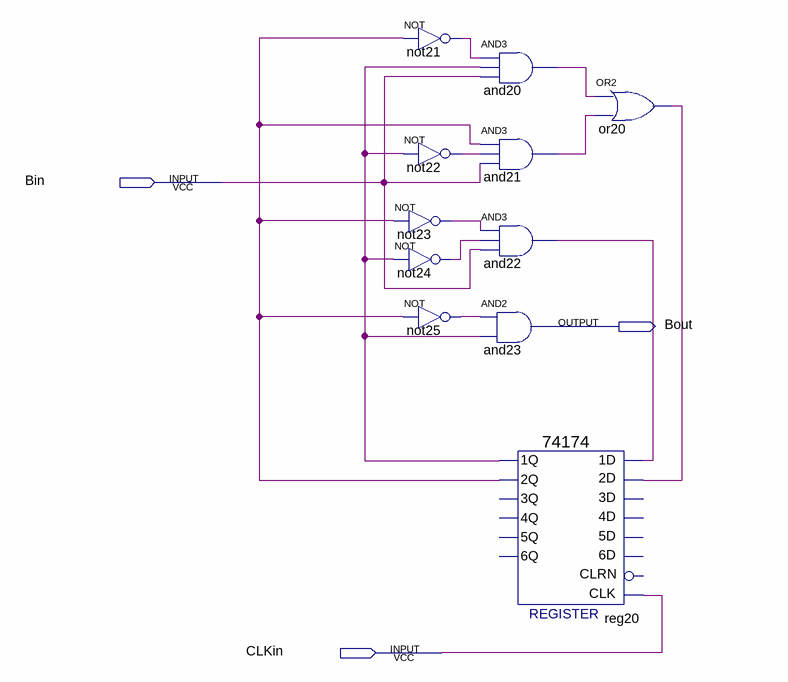
[diagram p0: schematic sheet]
// Quartus schematic BSync.bdf as structural Verilog: 11 symbols, 3 pins
module BSync (
  input  Bin,
  input  CLKin,
  output Bout
);

  wire and20_out, and21_out, and22_out, not21_out, not22_out, not23_out, not24_out, not25_out, or20_out,
       reg20_1q, reg20_2q;

  not not21 (not21_out, reg20_2q);
  not not22 (not22_out, reg20_1q);
  not not23 (not23_out, reg20_2q);
  not not24 (not24_out, reg20_1q);
  not not25 (not25_out, reg20_2q);
  and and20 (and20_out, not21_out, reg20_1q, Bin);
  and and21 (and21_out, reg20_2q, not22_out, Bin);
  and and22 (and22_out, not23_out, not24_out, Bin);
  and and23 (Bout, not25_out, reg20_1q);
  \74174  reg20 (
    .CLK(CLKin), .\1D (and22_out), .\2D (or20_out), .\1Q (reg20_1q), .\2Q (reg20_2q));  // open: 4D, 3D, 5D, 6D, CLRN, 4Q, 3Q, 6Q, 5Q
  or or20 (or20_out, and20_out, and21_out);
endmodule
